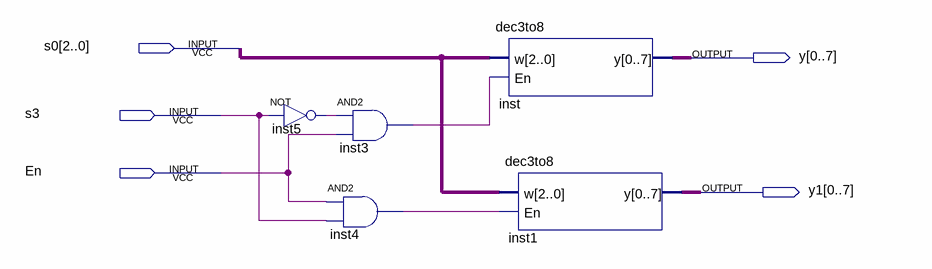
[diagram p0: schematic sheet]
// Quartus schematic dec4to16.bdf as structural Verilog: 5 symbols, 5 pins
module dec4to16 (
  input  [2:0] s0,
  input  s3,
  input  En,
  output [0:7] y,
  output [0:7] y1
);

  wire inst3_out, inst4_out, inst5_out;

  not inst5 (inst5_out, s3);
  and inst3 (inst3_out, inst5_out, En);
  and inst4 (inst4_out, En, s3);
  dec3to8 inst (.w(s0), .En(inst3_out), .y(y));
  dec3to8 inst1 (.w(s0), .En(inst4_out), .y(y1));
endmodule
